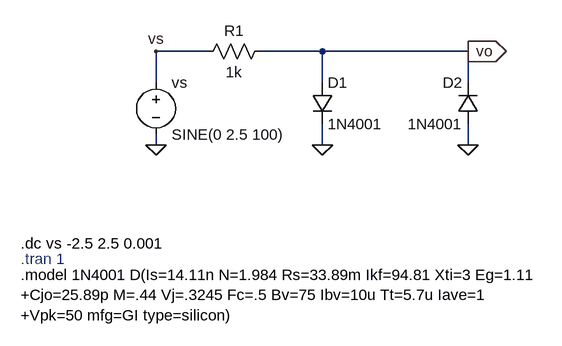
[diagram p0: schematic Lab6p3.asc]
Lab6p3.asc, the LTspice schematic file:
Version 4
SHEET 1 920 680
WIRE 288 16 208 16
WIRE 464 16 368 16
WIRE 688 16 464 16
WIRE 208 64 208 16
WIRE 464 64 464 16
WIRE 688 64 688 16
WIRE 208 160 208 144
WIRE 464 160 464 128
WIRE 688 160 688 128
FLAG 464 160 0
FLAG 208 160 0
FLAG 688 16 vo
IOPIN 688 16 Out
FLAG 208 16 vs
FLAG 688 160 0
SYMBOL diode 448 64 R0
SYMATTR InstName D1
SYMATTR Value 1N4001
SYMBOL voltage 208 48 R0
WINDOW 123 0 0 Left 0
WINDOW 39 0 0 Left 0
SYMATTR InstName vs
SYMATTR Value SINE(0 2.5 100)
SYMBOL res 384 0 R90
WINDOW 0 0 56 VBottom 2
WINDOW 3 32 56 VTop 2
SYMATTR InstName R1
SYMATTR Value 1k
SYMBOL diode 704 128 R180
WINDOW 0 24 64 Left 2
WINDOW 3 24 0 Left 2
SYMATTR InstName D2
SYMATTR Value 1N4001
TEXT 0 360 Left 2 !.model 1N4001 D(Is=14.11n N=1.984 Rs=33.89m Ikf=94.81 Xti=3 Eg=1.11\n+Cjo=25.89p M=.44 Vj=.3245 Fc=.5 Bv=75 Ibv=10u Tt=5.7u Iave=1\n+Vpk=50 mfg=GI type=silicon)
TEXT 0 336 Left 2 ;.tran 1
TEXT 0 312 Left 2 !.dc vs -2.5 2.5 0.001

The netlist it stands for:
* Lab6p3.asc
D1 vo 0 1N4001
vs vs 0 SINE(0 2.5 100)
R1 vo vs 1k
D2 0 vo 1N4001
.model D D
.lib standard.dio
.model 1N4001 D(Is=14.11n N=1.984 Rs=33.89m Ikf=94.81 Xti=3 Eg=1.11
+Cjo=25.89p M=.44 Vj=.3245 Fc=.5 Bv=75 Ibv=10u Tt=5.7u Iave=1
+Vpk=50 mfg=GI type=silicon)
* .tran 1
.dc vs -2.5 2.5 0.001
.backanno
.end